# EAGLE design uC_Board_V0 (EAGLE 6.4)
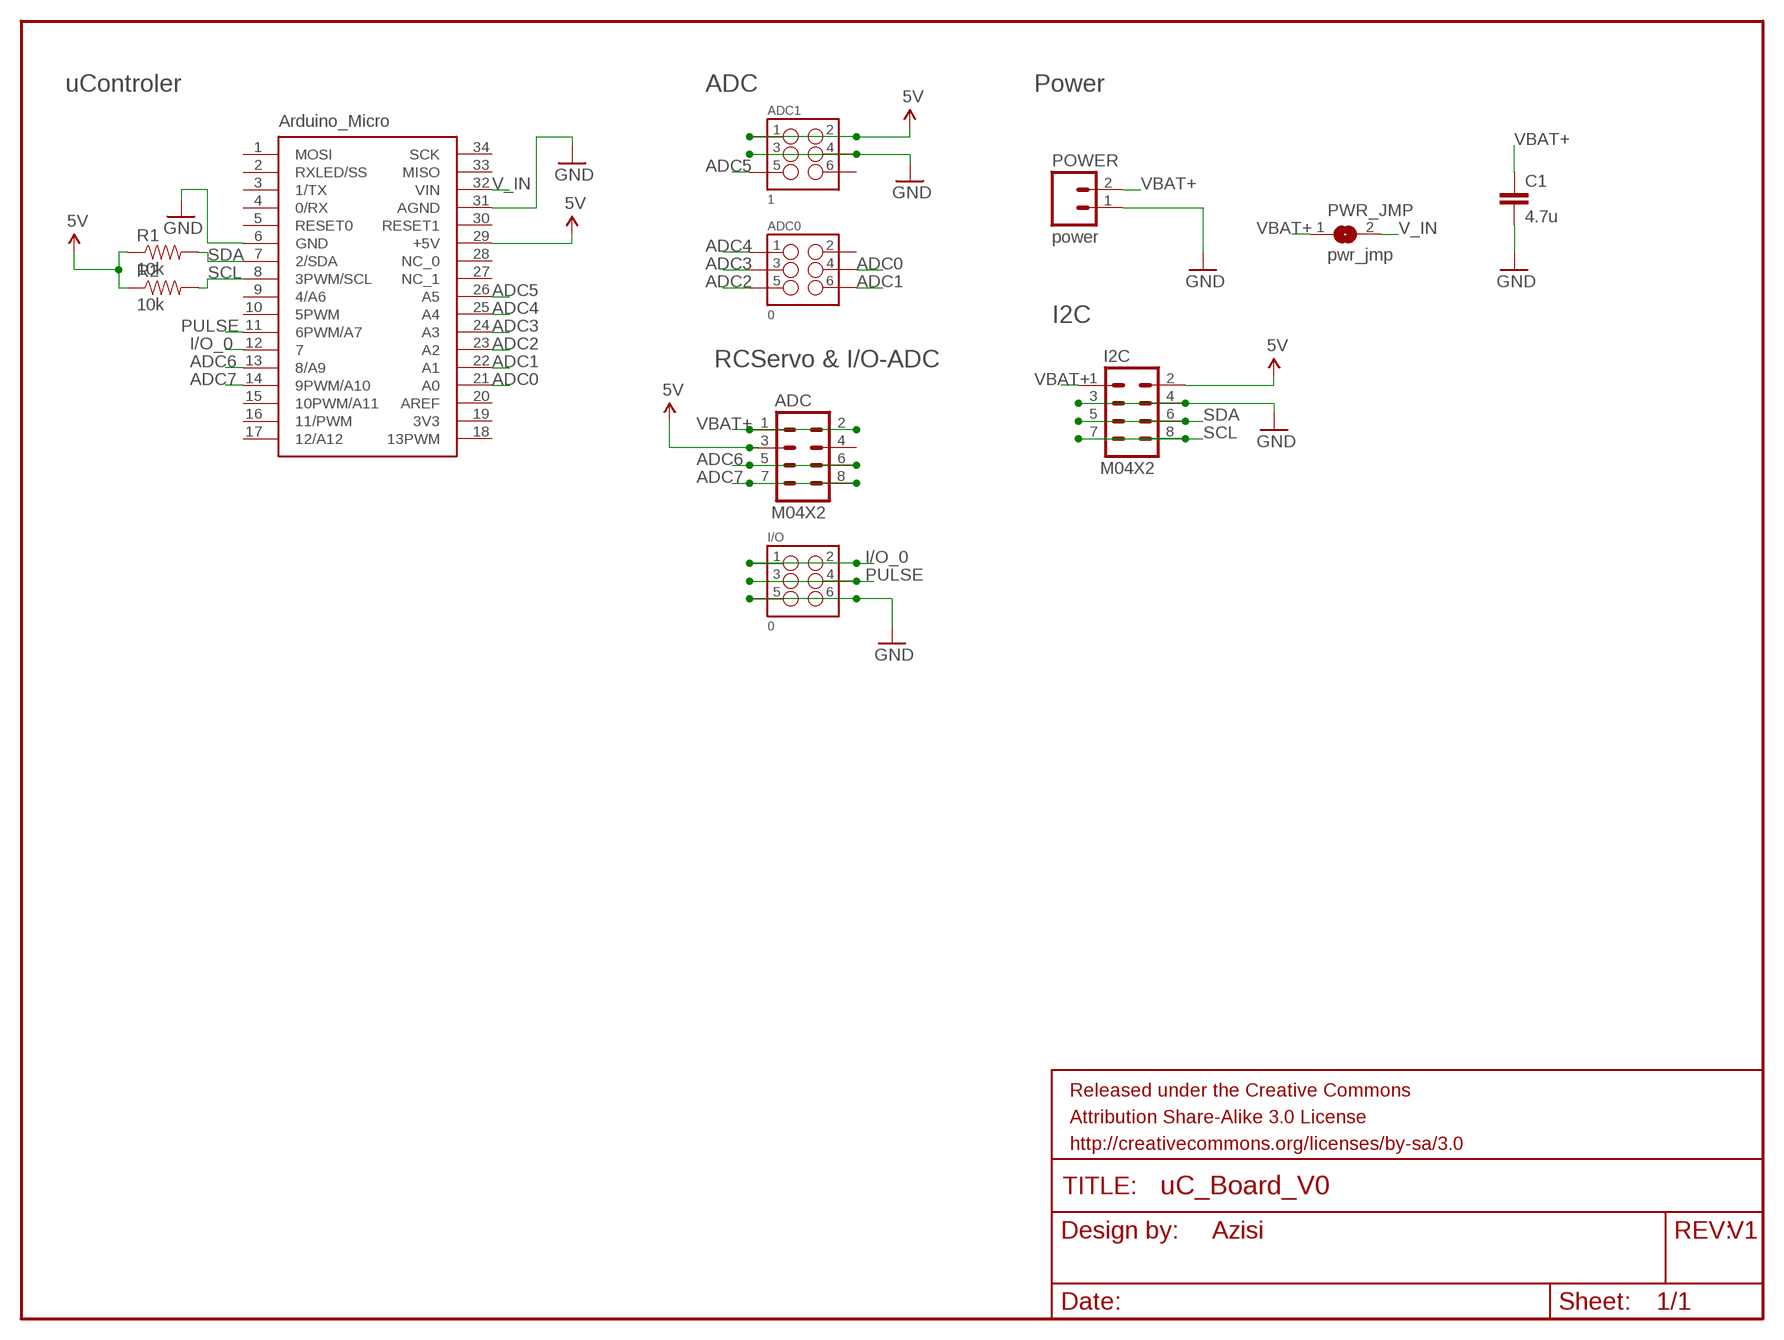
[diagram p0: schematic, sheet 1]

## Parts
ADC  M04X2  [2X4]
ADC0  0  M03X22X3_SILK_SM  [2X3]
ADC1  1  M03X22X3_SILK_SM  [2X3]
C1  4.7u  CAP1210  [1210]
FRAME1  FRAME-LETTER  [CREATIVE_COMMONS]
I2C  M04X2  [2X4]
I/O  0  M03X22X3_SILK_SM  [2X3]
POWER  power  M02PTH3  [1X02_LONGPADS]
PWR_JMP  pwr_jmp  SJW  [SJW]
R1  10k  RESISTOR1206  [1206]
R2  10k  RESISTOR1206  [1206]
U$1  uC  ARDUINO_MICROARDUINO_BOARD  [ARDUINO_MICRO]

## Nets
5V: ADC1.1 ADC1.2 ADC.3 I2C.2 R1.1 R2.1 U$1.29(+5V)
ADC0: ADC0.4 U$1.21(A0)
ADC1: ADC0.6 U$1.22(A1)
ADC2: ADC0.5 U$1.23(A2)
ADC3: ADC0.3 U$1.24(A3)
ADC4: ADC0.1 U$1.25(A4)
ADC5: ADC1.5 U$1.26(A5)
ADC6: ADC.5 ADC.6 U$1.13(8/A9)
ADC7: ADC.7 ADC.8 U$1.14(9PWM/A10)
GND: ADC1.3 ADC1.4 C1.2 I2C.3 I2C.4 I/O.5 I/O.6 POWER.1 U$1.6(GND) U$1.31(AGND)
I/O_0: I/O.1 I/O.2 U$1.12
PULSE: I/O.3 I/O.4 U$1.11(6PWM/A7)
SCL: I2C.7 I2C.8 R2.2 U$1.8(3PWM/SCL)
SDA: I2C.5 I2C.6 R1.2 U$1.7(2/SDA)
V_IN: PWR_JMP.2 U$1.32(VIN)
VBAT+: ADC.1 ADC.2 C1.1 I2C.1 POWER.2 PWR_JMP.1
Unconnected: ADC0.2 ADC1.6 ADC.4 U$1.1(MOSI) U$1.2(RXLED/SS) U$1.3(1/TX) U$1.4(0/RX) U$1.5(RESET0) U$1.9(4/A6) U$1.10(5PWM) U$1.15(10PWM/A11) U$1.16(11/PWM) U$1.17(12/A12) U$1.18(13PWM) U$1.19(3V3) U$1.20(AREF) U$1.27(NC_1) U$1.28(NC_0) U$1.30(RESET1) U$1.33(MISO) U$1.34(SCK)

## Notes on the sheet
- uControler | ADC | Power
- I2C
- RCServo & I/O-ADC
- Azisi | V1

## Library data of the parts
ADC I2C = SparkFun-Connectors:M04X2: .1" header, two rows of four.
ADC0 ADC1 I/O = SparkFun-Connectors:M03X2: 2x3 .1" header. Shrouded, with keying- CONN-10681 SMT- CONN-11415 Pogo pins- HW-11044
C1 = SparkFun-Capacitors:CAP: Capacitor Standard 0603 ceramic capacitor, and 0.1" leaded capacitor.
FRAME1 = SparkFun-Aesthetics:FRAME-LETTER: Schematic Frame Standard 8.5x11 US Letter frame
POWER = SparkFun-Connectors:M02: Header 2 Standard 2-pin 0.1" header. Use with straight break away headers (SKU : PRT-00116), right angle break away headers (PRT-00553), swiss pins (PRT-00743), machine pins (PRT-00117), and female headers (PRT-00115). Molex polarized connector foot print use with SKU : PRT-08233 with associated crimp pins and housings.
PWR_JMP = jumper:SJ: SMD solder JUMPER
R1 R2 = SparkFun-Passives:RESISTOR: Resistor Basic schematic elements and footprints for 0603, 1206, and PTH resistors.
U$1 = Arduino_Micro:ARDUINO_MICRO: Arduino Micro

## Board
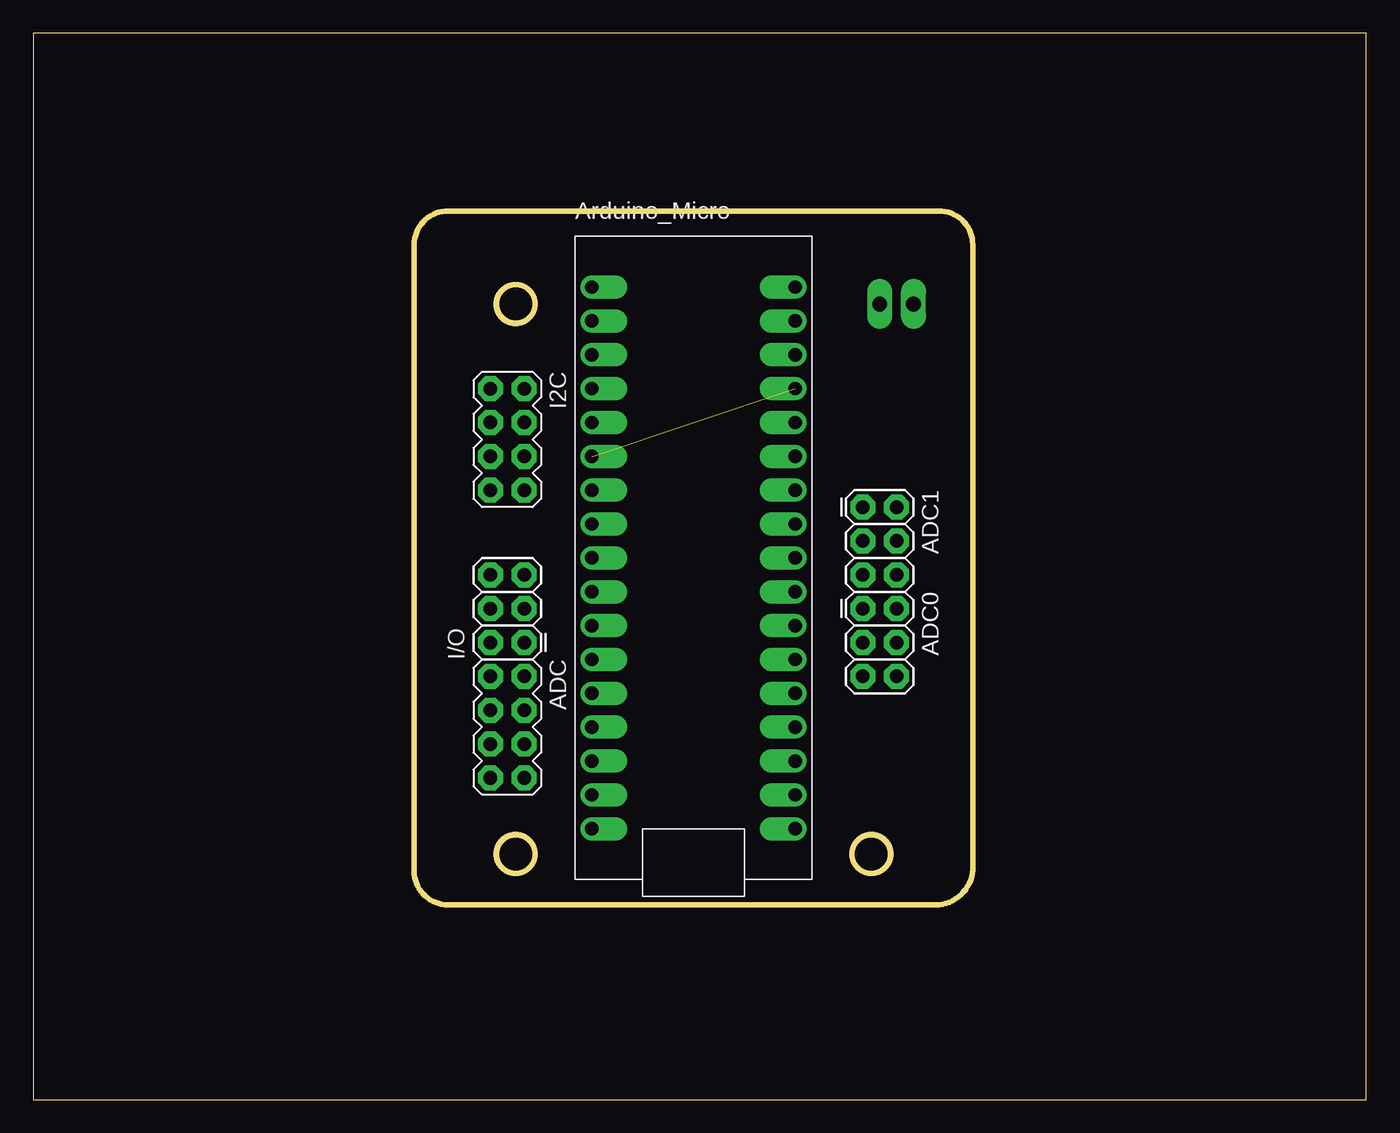
[diagram p1: board, top side]
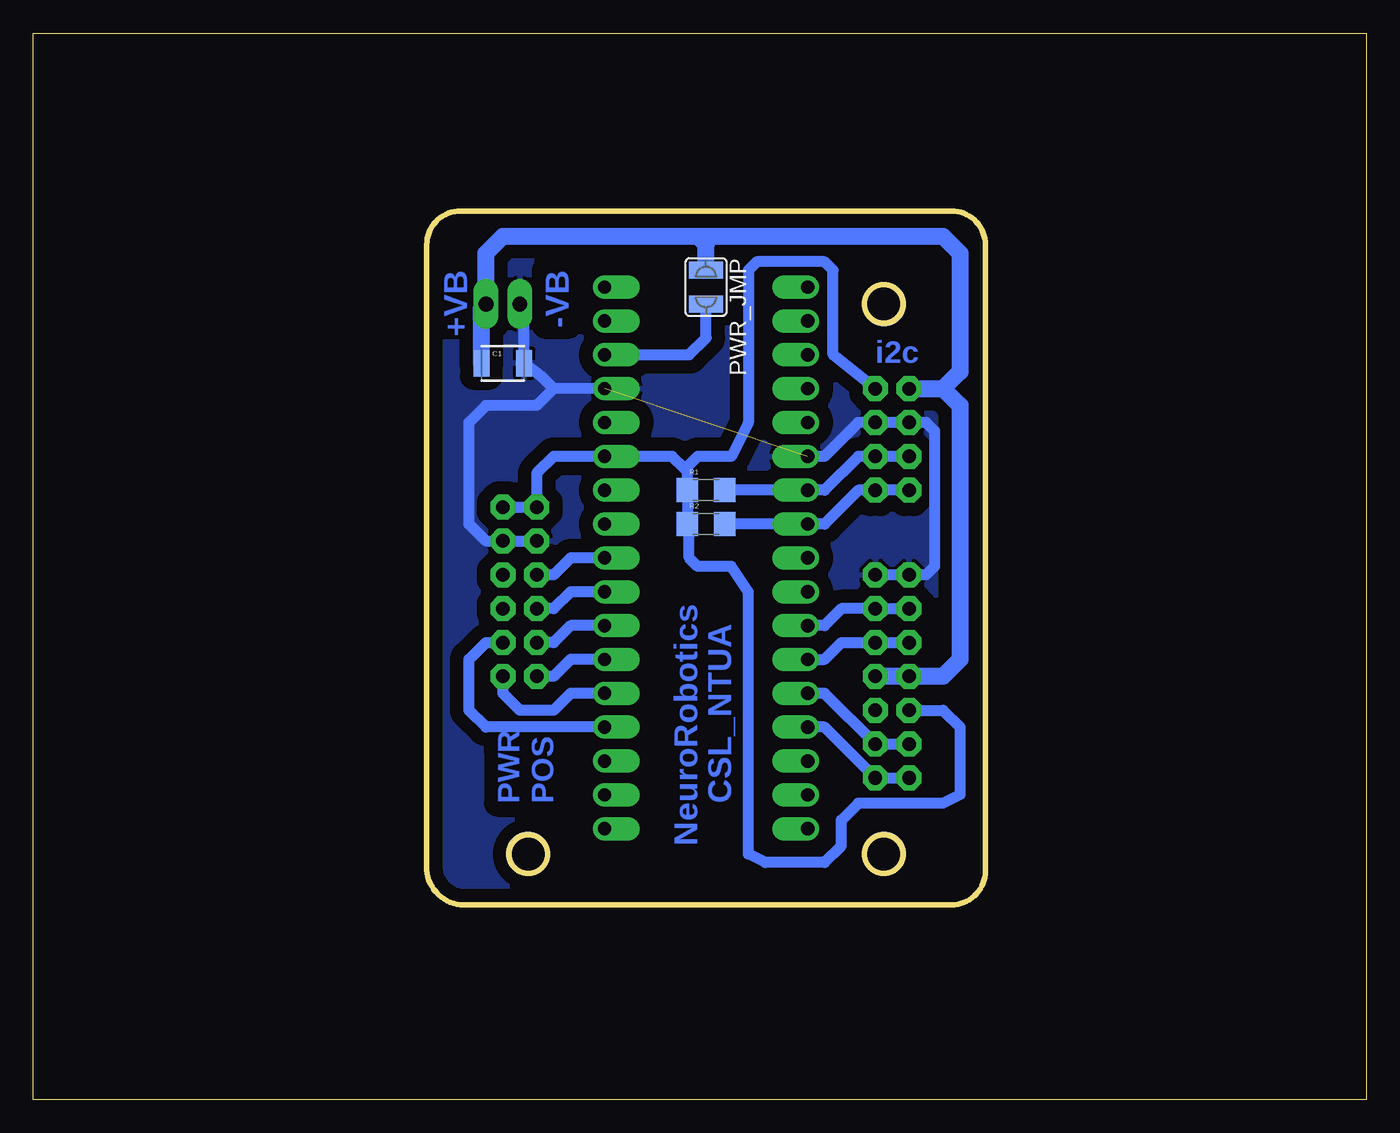
[diagram p2: board, bottom side, seen from below]

Size 100 x 80 mm. Coordinates in mm from the lower left corner, seen from the top.
Outline: 0,0 100,0 100,80 0,80 0,0
Outline: 31.11,66.67 arc90 28.57,64.14 28.57,17.14 arc90 31.11,14.61 67.94,14.61 arc90 70.48,17.78 70.48,64.14 arc90 67.94,66.67 31.11,66.67
Outline: circle at 36.2,18.41 radius 1.42
Outline: circle at 62.87,18.41 radius 1.42
Outline: circle at 36.2,59.69 radius 1.42
Copper layers (1*16): Top 0.035mm / dielectric 1.5mm / Bottom 0.035mm
Design rules "default": minimum track width 10mil, minimum drill 24mil, track to track 8mil, track to pad 8mil, pad to pad 8mil, via to via 8mil, smd to smd 8mil, copper to edge 40mil, drill to drill 8mil, minimum pad ring 10mil, minimum via ring 8mil, stop-mask expansion 4mil, vias tented up to drill 0mil, thermal gap 10mil
Holes 3.2 mm at 36.2,18.41 62.87,18.41 36.2,59.69

### Footprints (pad centres in the part's own frame; a part is rotated, then mirrored left to right if it is on the bottom)
2X4 = drill 1.016 pad 1.88 octagon: 1 -3.81,-1.27; 2 -3.81,1.27; 3 -1.27,-1.27; 4 -1.27,1.27; 5 1.27,-1.27; 6 1.27,1.27; 7 3.81,-1.27; 8 3.81,1.27
2X3 = drill 1.016 pad 1.88 octagon: 1 0,0; 2 0,2.54; 3 2.54,0; 4 2.54,2.54; 5 5.08,0; 6 5.08,2.54
1210 = smd 1.2 x 2: 1 -1.6,0; 2 1.6,0
1X02_LONGPADS = drill 1.118 pad 1.88 long: 1 0,0; 2 2.54,0
SJW = smd 1.27 x 2.54: 1 -1.27,0; 2 1.27,0
1206 = smd 1.6 x 1.8: 1 -1.4,0; 2 1.4,0
ARDUINO_MICRO = drill 1 pad 1.778 offset: 1 -7.62,20.32; 2 -7.62,17.78; 3 -7.62,15.24; 4 -7.62,12.7; 5 -7.62,10.16; 6 -7.62,7.62; 7 -7.62,5.08; 8 -7.62,2.54; 9 -7.62,0; 10 -7.62,-2.54; 11 -7.62,-5.08; 12 -7.62,-7.62; 13 -7.62,-10.16; 14 -7.62,-12.7; 15 -7.62,-15.24; 16 -7.62,-17.78; 17 -7.62,-20.32; 18 7.62,-20.32; 19 7.62,-17.78; 20 7.62,-15.24; 21 7.62,-12.7; 22 7.62,-10.16; 23 7.62,-7.62; 24 7.62,-5.08; 25 7.62,-2.54; 26 7.62,0; 27 7.62,2.54; 28 7.62,5.08; 29 7.62,7.62; 30 7.62,10.16; 31 7.62,12.7; 32 7.62,15.24; 33 7.62,17.78; 34 7.62,20.32

### Placement (x,y rotation side)
ADC  35.56,27.94 270 top
ADC0  62.23,36.83 270 top
ADC1  62.23,44.45 270 top
C1  64.77,55.24 0 bottom
FRAME1  29.21,-8.89 0 top  (outside the outline)
I2C  35.56,49.53 270 top
I/O  36.83,34.29 90 top
POWER  63.5,59.69 0 top
PWR_JMP  49.53,60.96 270 bottom
R1  49.53,45.72 0 bottom
R2  49.53,43.18 0 bottom
U$1  49.53,40.64 0 top

### Tracks (layer width: path | path; a pad name or v marks a point on that pad's centre or on a via)
5V
  Bottom 0.813: 50.93,47.12 R1.1 R2.1 50.8,43.05 50.8,40.64 50.16,40.01 47.62,40.01 46.35,38.1 46.35,18.41 45.09,17.78 40.64,17.78 39.37,19.05 39.37,20.95 38.1,22.23 31.75,22.23 30.48,22.86 30.48,27.94 31.75,29.21 ADC.3 | 50.93,47.12 51.12,47.31 | 51.12,47.31 52.07,48.26 U$1.29 60.96,48.26 62.23,46.99 ADC1.1 ADC1.2 | 50.93,47.49 50.16,48.26 47.62,48.26 46.35,50.8 46.35,62.23 45.72,62.87 40.64,62.87 40.01,62.23 40.01,55.88 I2C.2 | 50.93,47.49 51.12,47.31 | 50.93,47.12 50.93,47.49
ADC0
  Bottom 0.813: U$1.21 66.04,27.94 67.31,29.21 67.31,33.02 66.04,34.29 ADC0.4
ADC1
  Bottom 0.813: U$1.22 59.69,30.48 60.96,29.21 63.5,29.21 64.77,30.48 ADC0.6
ADC2
  Bottom 0.813: U$1.23 59.69,33.02 60.96,31.75 ADC0.5
ADC3
  Bottom 0.813: U$1.24 59.69,35.56 60.96,34.29 ADC0.3
ADC4
  Bottom 0.813: U$1.25 59.69,38.1 60.96,36.83 ADC0.1
ADC5
  Bottom 0.813: U$1.26 59.69,40.64 60.96,39.37 ADC1.5
ADC6
  Bottom 0.813: U$1.13 40.64,30.48 ADC.6 ADC.5
ADC7
  Bottom 0.813: U$1.14 40.64,27.94 ADC.8 ADC.7
GND  (1 unrouted)
  Bottom 0.813: ADC1.3 ADC1.4 66.04,41.91 67.31,43.18 67.31,50.8 66.04,52.07 62.23,52.07 60.96,53.34 | POWER.1 63.17,59.36 C1.2 61.9,54.28 60.96,53.34 | U$1.31 60.96,53.34 | I/O.5 I/O.6 33.02,39.37 32.38,40.01 32.38,50.16 33.02,50.8 I2C.3 I2C.4 38.1,50.8 40.64,48.26 U$1.6
  pour Bottom (isolate 1.016): 29.21,64.14 29.21,17.14 arc90 31.11,15.24 67.31,15.24 arc90 69.85,17.14 69.85,64.14 arc90 67.94,66.04 31.11,66.04 arc90
I/O_0
  Bottom 0.813: U$1.12 40.64,33.02 39.37,34.29 I/O.1 I/O.2
PULSE
  Bottom 0.813: U$1.11 40.64,35.56 39.37,36.83 I/O.3 I/O.4
SCL
  Bottom 0.813: I2C.7 I2C.8 38.1,45.72 40.64,43.18 U$1.8 R2.2
SDA
  Bottom 0.813: I2C.5 I2C.6 38.1,48.26 40.64,45.72 U$1.7 R1.2
V_IN
  Bottom 0.813: U$1.32 50.8,55.88 49.53,57.15 PWR_JMP.2
VBAT+
  Bottom 1.27: C1.1 66.37,59.36 POWER.2 66.04,63.5 64.77,64.77 50.16,64.77 | ADC.2 ADC.1 31.75,31.75 30.48,33.02 30.48,52.07 31.75,53.34 | 50.16,64.77 31.75,64.77 30.48,63.5 30.48,54.61 31.75,53.34 | I2C.1 31.75,53.34 | PWR_JMP.1 49.53,64.14 50.16,64.77

### Text on the board
Bottom: -VB | +VB | i2c | CSL_NTUA | POS | PWR | NeuroRobotics